# Altium project BLDC_Core.PrjPcb
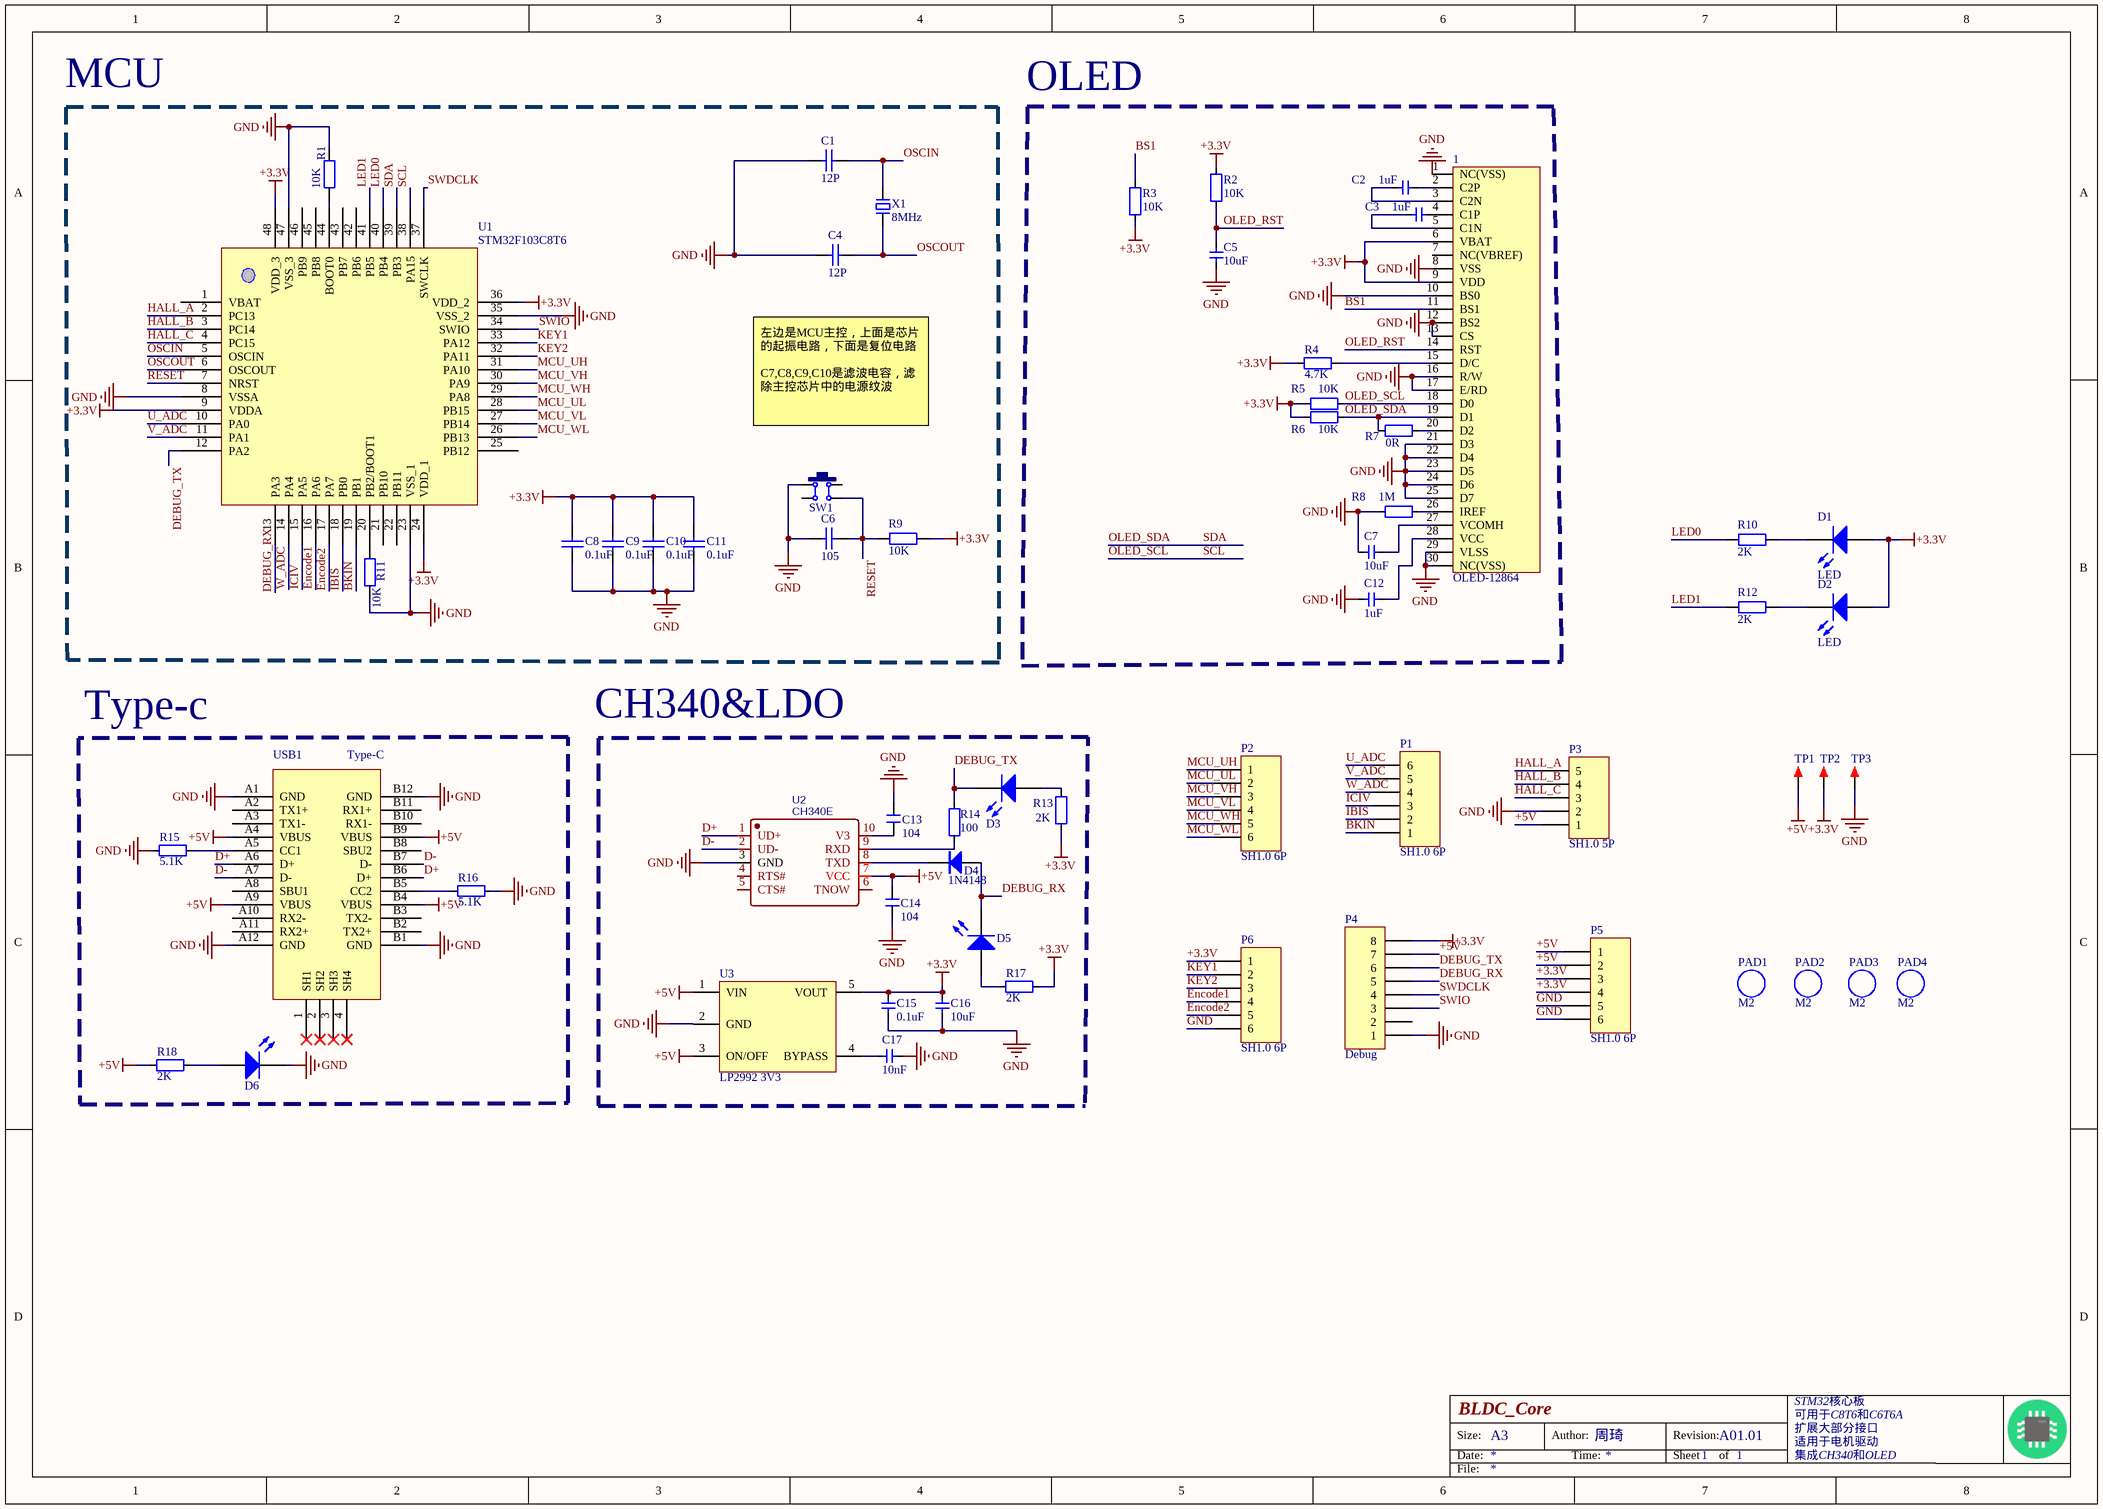
[diagram p0: 原理图.SchDoc]
1 sheet, 61 parts. Net scope: global (net labels, ports and power ports of the same name join across sheets).
Board file: PCB.PcbDoc

## Sheet 原理图.SchDoc: BLDC_Core
size A3; Author: 周琦; Organization: STM32核心板; Address1: 可用于C8T6和C6T6A; Address2: 扩展大部分接口; Address3: 适用于电机驱动; Address4: 集成CH340和OLED; DocumentNumber: 1; Revision: A01.01; SheetNumber: 1; SheetTotal: 1

### Parts
1  OLED-12864  [OLED-12864-1.3-TOP]
C1  12P  [C0603_M]
C2  1uF  [C0402_L]
C3  1uF  [C0402_L]
C4  12P  [C0603_M]
C5  10uF  [C0402_L]
C6  105  [C0402_L]
C7  10uF  [C0402_L]
C8  0.1uF  [C0402_L]
C9  0.1uF  [C0402_L]
C10  0.1uF  [C0402_L]
C11  0.1uF  [C0402_L]
C12  1uF  [C0402_L]
C13  104  [C0402_L]
C14  104  [C0402_L]
C15  0.1uF  [C0402_L]
C16  10uF  [C0402_L]
C17  10nF  [C0402_L]
D1  LED  [LED0603_B]
D2  LED  [LED0603_B]
D3  LED0  [LED0603_G]  (value not drawn)
D4  1N4148  [SOD-123]
D5  LED0  [LED0603_G]  (value not drawn)
D6  LED0  [LED0603_R]  (value not drawn)
P1  SH1.0 6P  [SH 1.0-WS-6P]
P2  SH1.0 6P  [SH 1.0-WS-6P]
P3  SH1.0 5P  [SH 1.0-LS-5P]
P4  Debug  [FPC0.5 2H-WS-8P]
P5  SH1.0 6P  [SH 1.0-WS-6P]
P6  SH1.0 6P  [SH 1.0-WS-6P]
PAD1  M2  [M2]
PAD2  M2  [M2]
PAD3  M2  [M2]
PAD4  M2  [M2]
R1  10K  [R0402_L]
R2  10K  [R0402_L]
R3  10K  [R0402_L]
R4  4.7K  [R0402_L]
R5  10K  [R0402_L]
R6  10K  [R0402_L]
R7  0R  [R0402_L]
R8  1M  [R0402_L]
R9  10K  [R0402_L]
R10  2K  [R0402_L]
R11  10K  [R0402_L]
R12  2K  [R0402_L]
R13  2K  [R0402_L]
R14  100  [R0402_L]
R15  5.1K  [R0402_L]
R16  5.1K  [R0402_L]
R17  2K  [R0402_L]
R18  2K  [R0402_L]
SW1  6x6x5  [TSW SMD-4*4*1.5]  (value not drawn)
TP1  TEST  [TEST 1.6]  (value not drawn)
TP2  TEST  [TEST 1.6]  (value not drawn)
TP3  TEST  [TEST 1.6]  (value not drawn)
U1  STM32F103C8T6  [LQFP48-7*7]
U2  CH340E  [MSOP10_M]
U3  LP2992 3V3  [SOT23-5]
USB1  Type-C  [USB-C-SMD_16P]
X1  8MHz  [OSC 4025-4P]

### Blocks framed on the sheet
MCU: C1 C4 C6 C8-C11 R1 R9 R11 SW1 U1 X1
OLED: 1 C2 C3 C5 C7 C12 R2-R8
Type-c: D6 R15 R16 R18 USB1

### Nets
+3.3V: 1.6(VBAT) 1.9(VDD) C8.1 C9.1 C10.1 C11.1 C15.2 C16.2 D1.1(A) D2.1(A) P4.8 P5.3 P5.4 P6.1 R2.2 R3.1 R4.2 R5.1 R6.1 R9.2 R13.1 R17.1 TP2.1 U1.9(VDDA) U1.24(VDD_1) U1.36(VDD_2) U1.48(VDD_3) U3.5(VOUT)
+5V: C14.1 P3.1 P4.7 P5.1 P5.2 R18.1 TP1.1 U2.7(VCC) U3.1(VIN) U3.3(ON/OFF) USB1.A4(VBUS) USB1.A9(VBUS) USB1.B4(VBUS) USB1.B9(VBUS)
GND: 1.1(NC(VSS)) 1.8(VSS) 1.10(BS0) 1.12(BS2) 1.13(CS) 1.16(R/W) 1.17(E/RD) 1.21(D3) 1.22(D4) 1.23(D5) 1.24(D6) 1.25(D7) 1.29(VLSS) 1.30(NC(VSS)) C1.1 C4.1 C5.1 C6.1 C7.2 C8.2 C9.2 C10.2 C11.2 C12.2 C13.1 C14.2 C15.1 C16.1 C17.1 D6.2(K) P3.2 P4.1 P5.5 P5.6 P6.6 R1.2 R8.1 R11.1 R15.1 R16.1 SW1.1 TP3.1 U1.8(VSSA) U1.23(VSS_1) U1.35(VSS_2) U1.47(VSS_3) U2.3(GND) U3.2(GND) USB1.A1(GND) USB1.A12(GND) USB1.B1(GND) USB1.B12(GND)
BKIN: P1.1 U1.19(PB1)
BS1: 1.11(BS1) R3.2
D+: U2.1(UD+) USB1.A6(D+) USB1.B6(D+)
D-: U2.2(UD-) USB1.A7(D-) USB1.B7(D-)
DEBUG_RX: D4.1(A) D5.2(K) P4.5 U1.13(PA3)
DEBUG_TX: D3.2(K) P4.6 R14.1 U1.12(PA2)
Encode1: P6.4 U1.16(PA6)
Encode2: P6.5 U1.17(PA7)
HALL_A: P3.5 U1.2(PC13)
HALL_B: P3.4 U1.3(PC14)
HALL_C: P3.3 U1.4(PC15)
IBIS: P1.2 U1.18(PB0)
ICIV: P1.3 U1.15(PA5)
KEY1: P6.2 U1.33(PA12)
KEY2: P6.3 U1.32(PA11)
LED0: R10.2 U1.40(PB4)
LED1: R12.2 U1.41(PB5)
MCU_UH: P2.1 U1.31(PA10)
MCU_UL: P2.2 U1.28(PB15)
MCU_VH: P2.3 U1.30(PA9)
MCU_VL: P2.4 U1.27(PB14)
MCU_WH: P2.5 U1.29(PA8)
MCU_WL: P2.6 U1.26(PB13)
OLED_RST: 1.14(RST) C5.2 R2.1
OLED_SCL: 1.18(D0) R5.2 U1.38(PA15)  [also labelled SCL]
OLED_SDA: 1.19(D1) R6.2 R7.2 U1.39(PB3)  [also labelled SDA]
OSCIN: C1.2 U1.5(OSCIN) X1.3
OSCOUT: C4.2 U1.6(OSCOUT) X1.1
RESET: C6.2 R9.1 SW1.3 U1.7(NRST)
SWDCLK: P4.4 U1.37(SWCLK)
SWIO: P4.3 U1.34(SWIO)
U_ADC: P1.6 U1.10(PA0)
V_ADC: P1.5 U1.11(PA1)
W_ADC: P1.4 U1.14(PA4)
Net1_2: 1.2(C2P) C2.1
Net1_3: 1.3(C2N) C2.2
Net1_4: 1.4(C1P) C3.1
Net1_5: 1.5(C1N) C3.2
Net1_15: 1.15(D/C) R4.1
Net1_20: 1.20(D2) R7.1
Net1_26: 1.26(IREF) R8.2
Net1_27: 1.27(VCOMH) C7.1
Net1_28: 1.28(VCC) C12.1
NetC13_2: C13.2 U2.10(V3)
NetC17_2: C17.2 U3.4(BYPASS)
NetD1_2: D1.2(K) R10.1
NetD2_2: D2.2(K) R12.1
NetD3_1: D3.1(A) R13.2
NetD4_2: D4.2(K) U2.8(TXD)
NetD5_1: D5.1(A) R17.2
NetD6_1: D6.1(A) R18.2
NetR1_1: R1.1 U1.44(BOOT0)
NetR11_2: R11.2 U1.20(PB2/BOOT1)
NetR14_2: R14.2 U2.9(RXD)
NetR15_2: R15.2 USB1.A5(CC1)
NetR16_2: R16.2 USB1.B5(CC2)

Not connected (* = marked no-connect by the designer): 1 7(NC(VBREF)); P4 2; SW1 2 4; U1 1(VBAT) 21(PB10) 22(PB11) 25(PB12) 42(PB6) 43(PB7) 45(PB8) 46(PB9); U2 4(RTS#) 5(CTS#) 6(TNOW); USB1 1(SH1)* 2(SH2)* 3(SH3)* 4(SH4)* A2(TX1+) A3(TX1-) A8(SBU1) A10(RX2-) A11(RX2+) B2(TX2+) B3(TX2-) B8(SBU2) B10(RX1-) B11(RX1+)

### Notes on the sheet
- 左边是MCU主控，上面是芯片的起振电路，下面是复位电路
  C7,C8,C9,C10是滤波电容，滤除主控芯片中的电源纹波
- CH340&LDO
- Size:
- Date:
- A3
- Author:
- Time:
- Revision:
- Sheet
- of
- File:

### Library data of the parts
1 = OLED-12864: 显示屏
C1 C4 C6 C8-C11 = C: 贴片电容; BOM名称: 无极性贴片电容; 联系卖家，免费查找封装: 唯一出售店铺网址https://shop463601444.taobao.com
C2 C3 C5 C7 C12 C15-C17 = 电容-0402: Capacitor; Value: 0.1u
C13 C14 = C: 无极性贴片电容; 版权归属: 源创客; BOM名称: 无极性贴片电容; 学习资源: www.ooocke.com
D1 D2 = LED: 发光二极管; 封装库来自淘宝卖家 ID：黄晶宝石: 其他店铺购入均为假冒，请立即申请退款，本店奖励现金5~20元
D3 D5 D6 = LED0: 发光二极管; Published: 8-Jun-2000; LatestRevisionDate: 08-Jul-2005; LatestRevisionNote: Mech Layer 1 removed.; PackageReference: LED-0; Publisher: Altium Limited
D4 = M7: 整流二极管; 版权归属: 源创客; BOM名称: 整流二极管; 学习资源: www.ooocke.com
P1 P2 P5 P6 = Header 6: Header, 6-Pin; LatestRevisionDate: 17-Jul-2002; LatestRevisionNote: Re-released for DXP Platform.; Publisher: Altium Limited
P3 = Header 5: Header, 5-Pin; LatestRevisionDate: 17-Jul-2002; LatestRevisionNote: Re-released for DXP Platform.; Publisher: Altium Limited
P4 = Header 8: Header, 8-Pin; LatestRevisionDate: 17-Jul-2002; LatestRevisionNote: Re-released for DXP Platform.; Publisher: Altium Limited
PAD1-PAD4 = M3: 铜柱孔; 联系卖家，免费查找封装: 唯一出售店铺网址https://shop463601444.taobao.com; BOM名称: 铜柱孔
R1 R9-R12 = R: 贴片电阻; 联系卖家，免费查找封装: 唯一出售店铺网址https://shop463601444.taobao.com; 封装库来自淘宝卖家ID：黄晶宝石: 其他店铺购入均为盗版假冒封装库，请立即申请退款; BOM名称: 贴片电阻
R2-R8 R13-R18 = 电阻-0402: Resistor; Value: 22R
SW1 = TSW SMD-6x6: 贴片6x6轻触开关; 版权归属: 源创客; BOM名称: 贴片6x6轻触开关; 学习资源: www.ooocke.com
TP1-TP3 = TEST: 测试点; 联系卖家，免费查找封装: 唯一出售店铺网址https://shop463601444.taobao.com; BOM名称: 测试点
U2 = CH340E: BOM_Manufacturer: WCH; subpart_no: 1; BOM_Supplier: LCSC; BOM_Manufacturer Part: CH340E; BOM_Supplier Part: C99652; BOM_JLCPCB Part Class: Extended Part; spicePre: U; spiceSymbolName: CH340E
U3 = LP2992: LDO
USB1 = USB-Type-C-TOP
X1 = XTAL-2P: 2脚无源脚晶振; 联系卖家，免费查找封装: 唯一出售店铺网址https://shop463601444.taobao.com; BOM名称: 2脚无源脚晶振